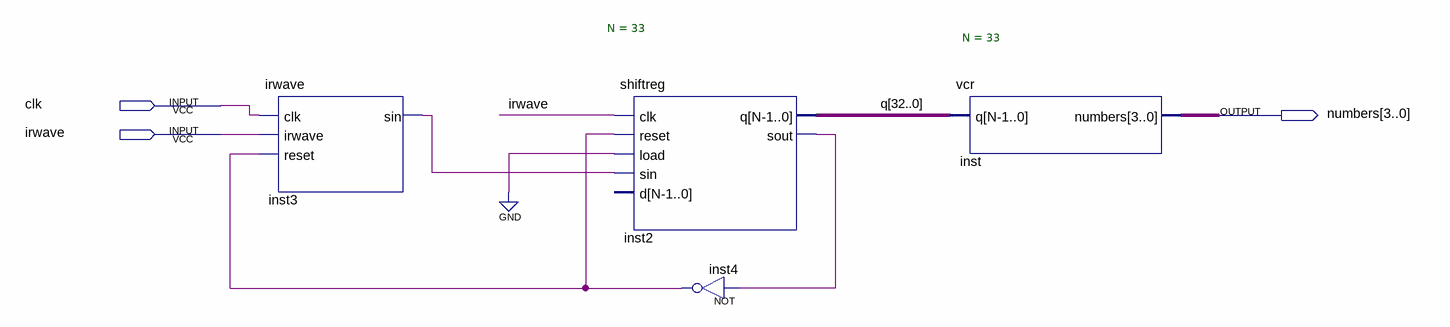
[diagram p0: schematic sheet]
// Quartus schematic vcr_test.bdf as structural Verilog: 4 symbols, 3 pins
module vcr_test (
  input  clk,
  input  irwave,
  output [3:0] numbers
);

  wire inst2_sout, inst3_sin, inst4_out;
  wire [32:0] q;

  irwave inst3 (.clk(clk), .irwave(irwave), .reset(inst4_out), .sin(inst3_sin));
  shiftreg #(.N(33)) inst2 (
    .clk(irwave), .reset(inst4_out), .load(1'b0), .sin(inst3_sin), .q(q), .sout(inst2_sout));  // open: d
  not inst4 (inst4_out, inst2_sout);
  vcr #(.N(33)) inst (.q(q), .numbers(numbers));
endmodule
